# EAGLE board controller (EAGLE 6.6.0)
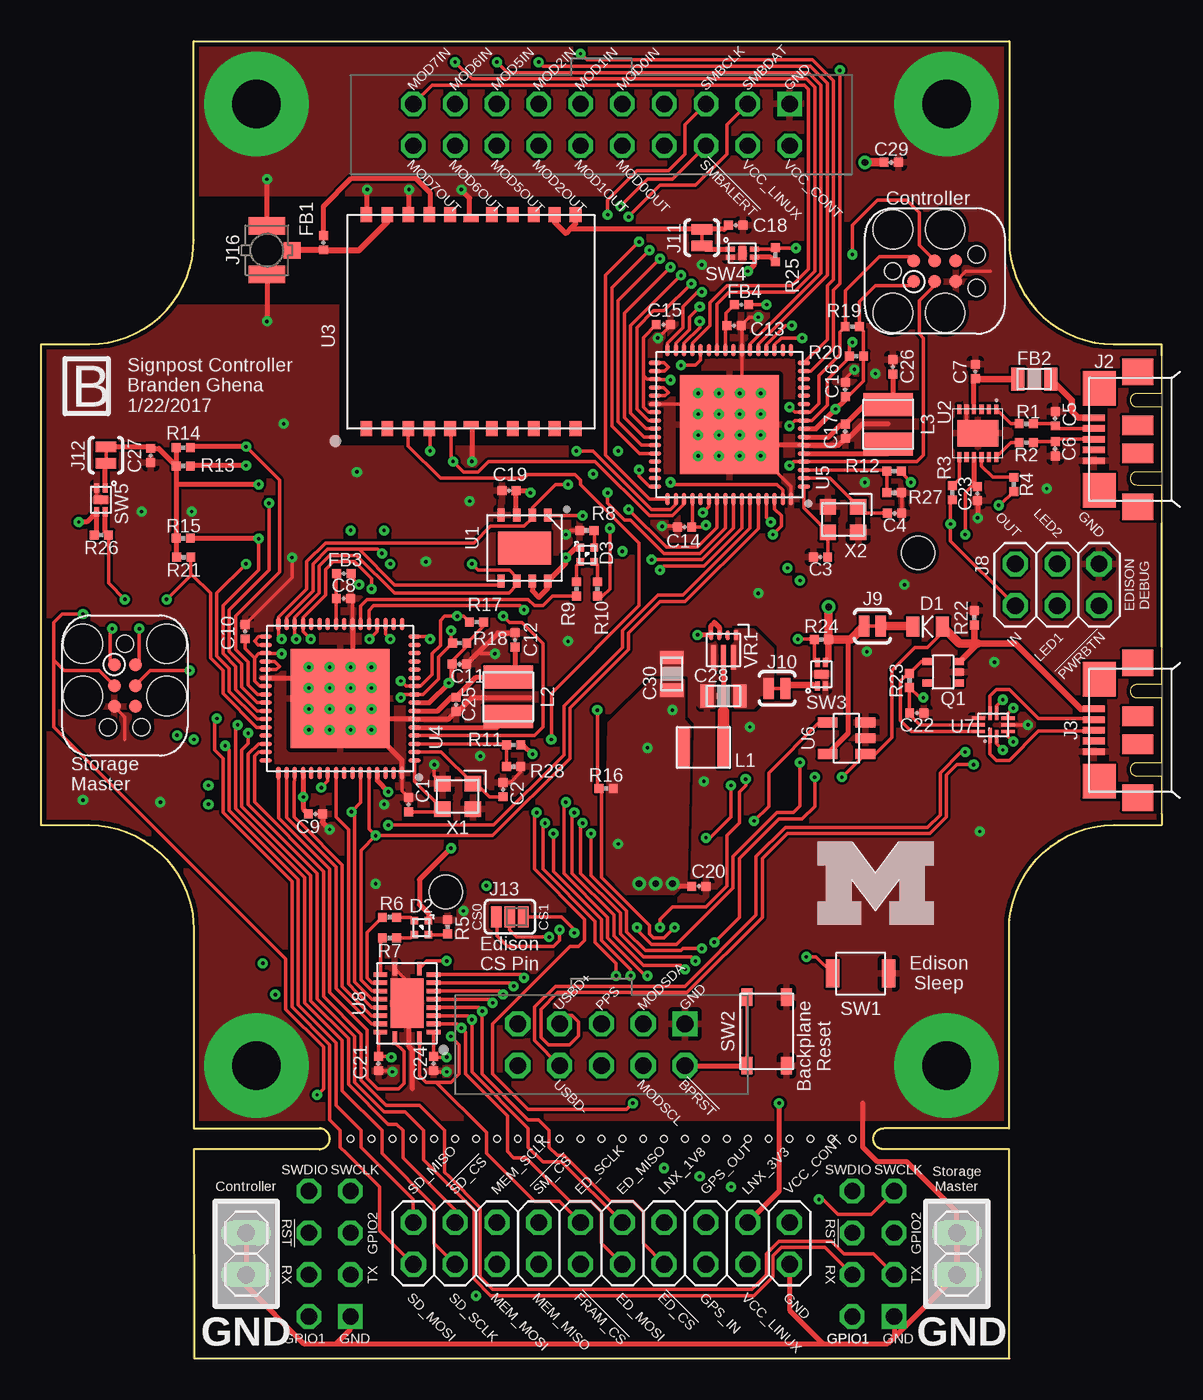
[diagram p5: board, top side]
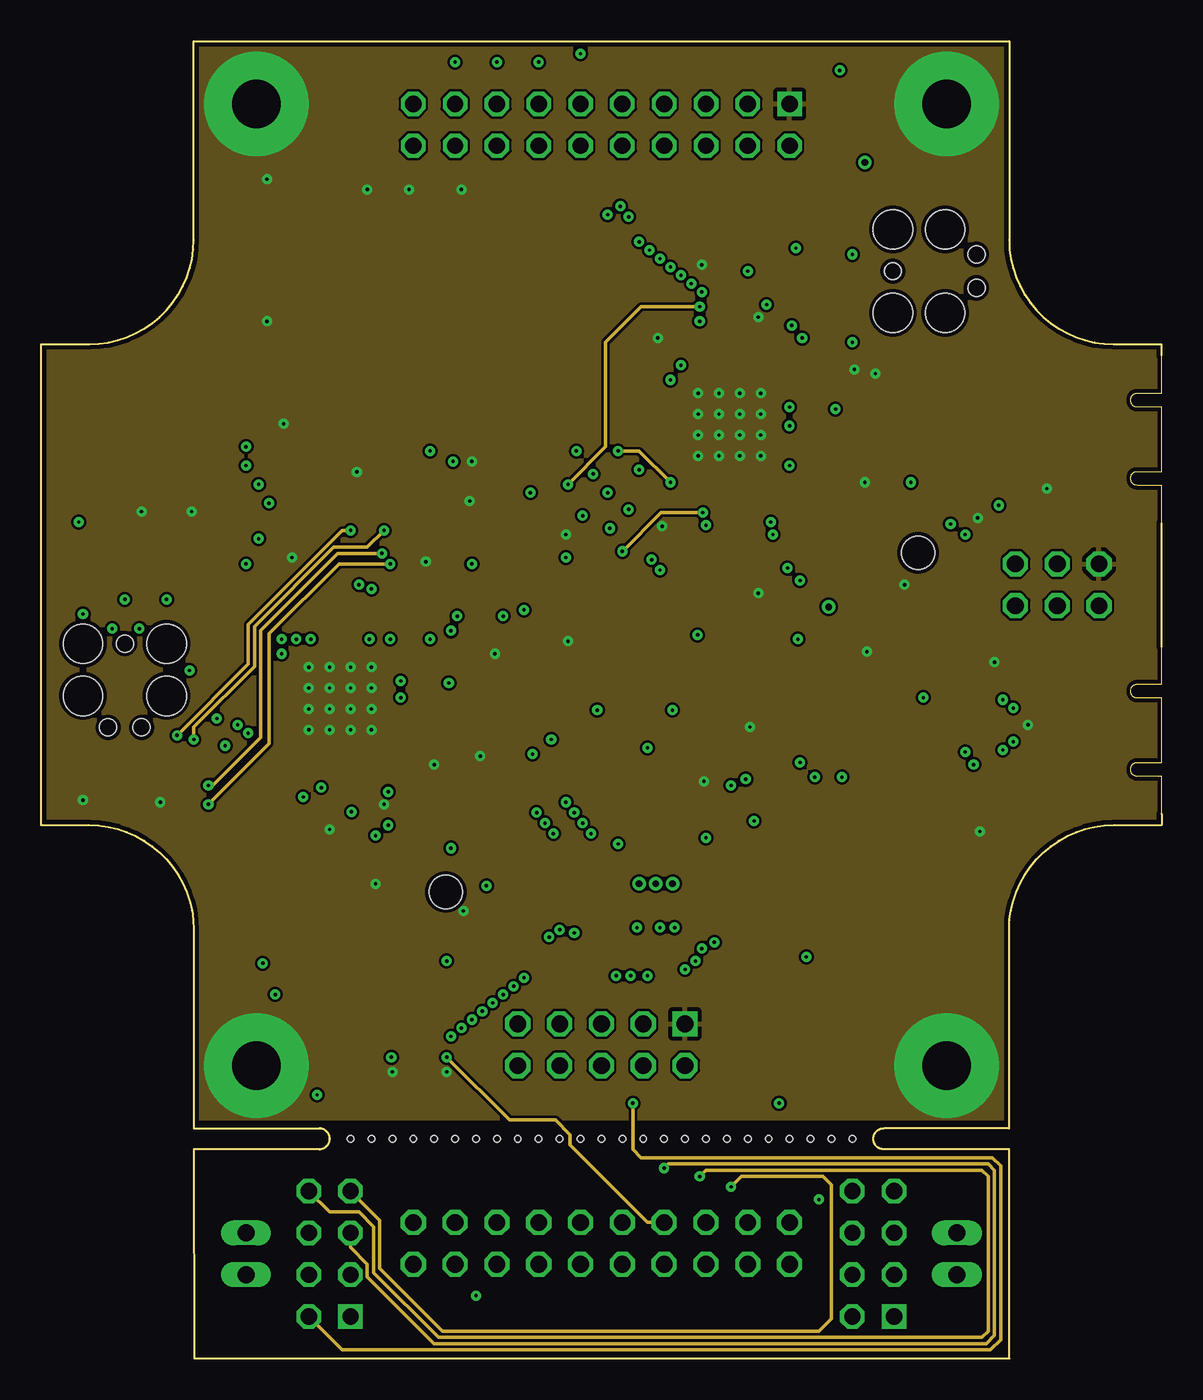
[diagram p6: board, inner layer Route2]
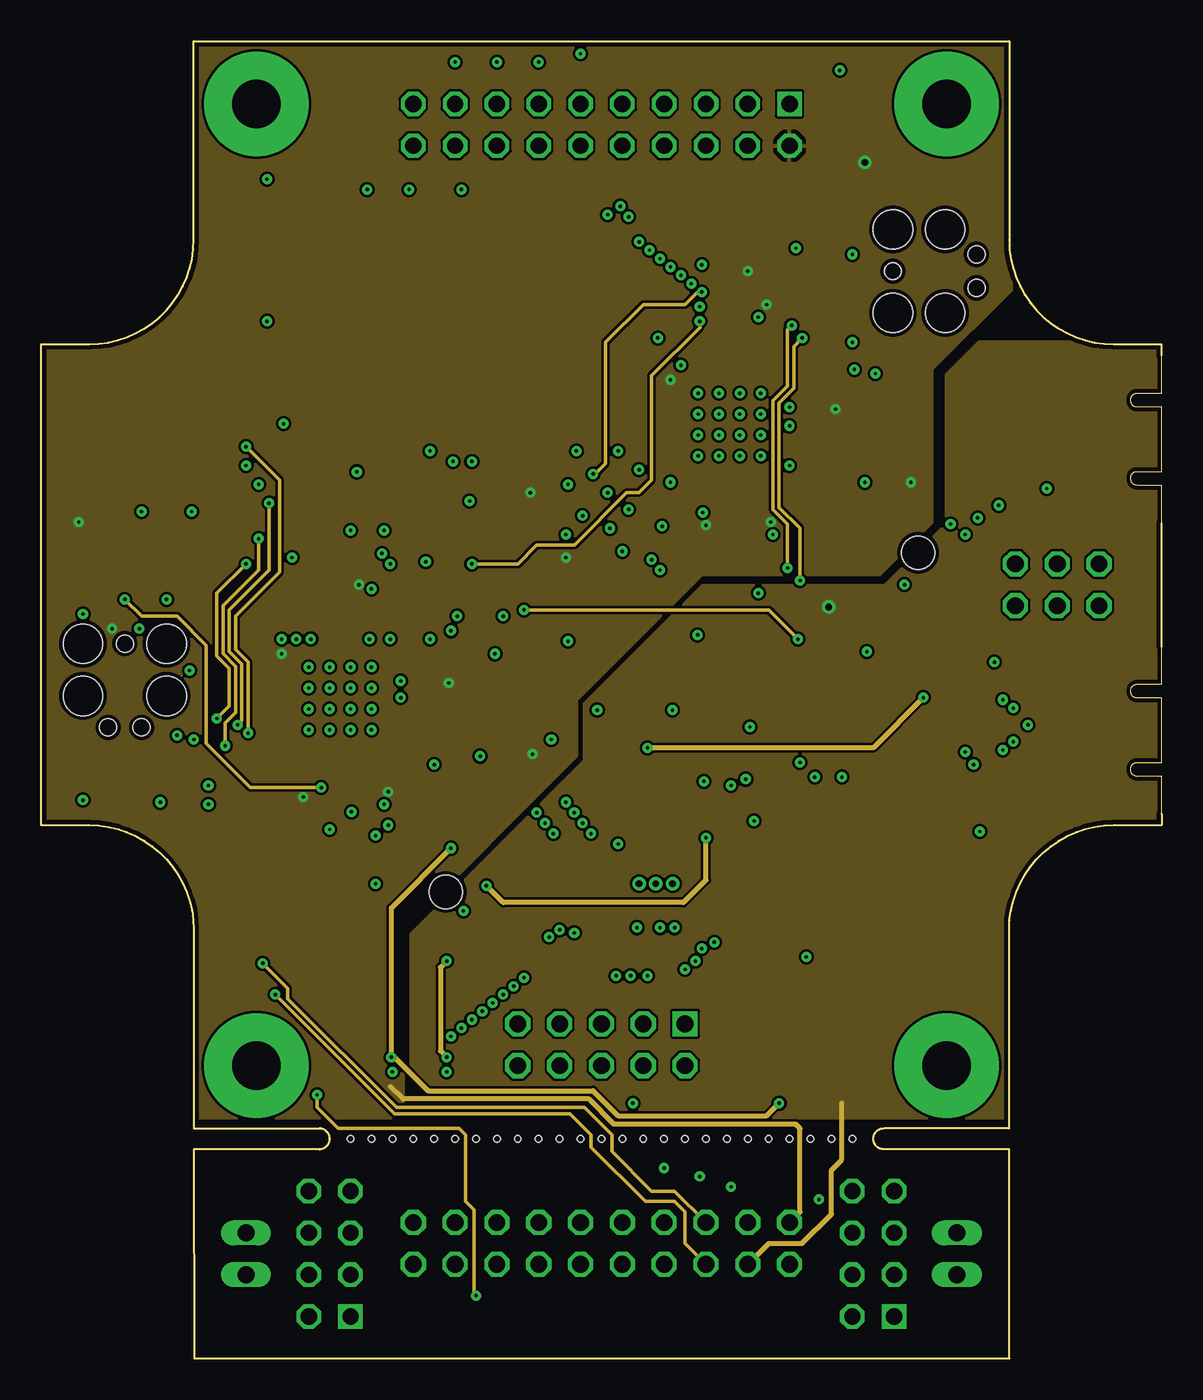
[diagram p7: board, inner layer Route15]
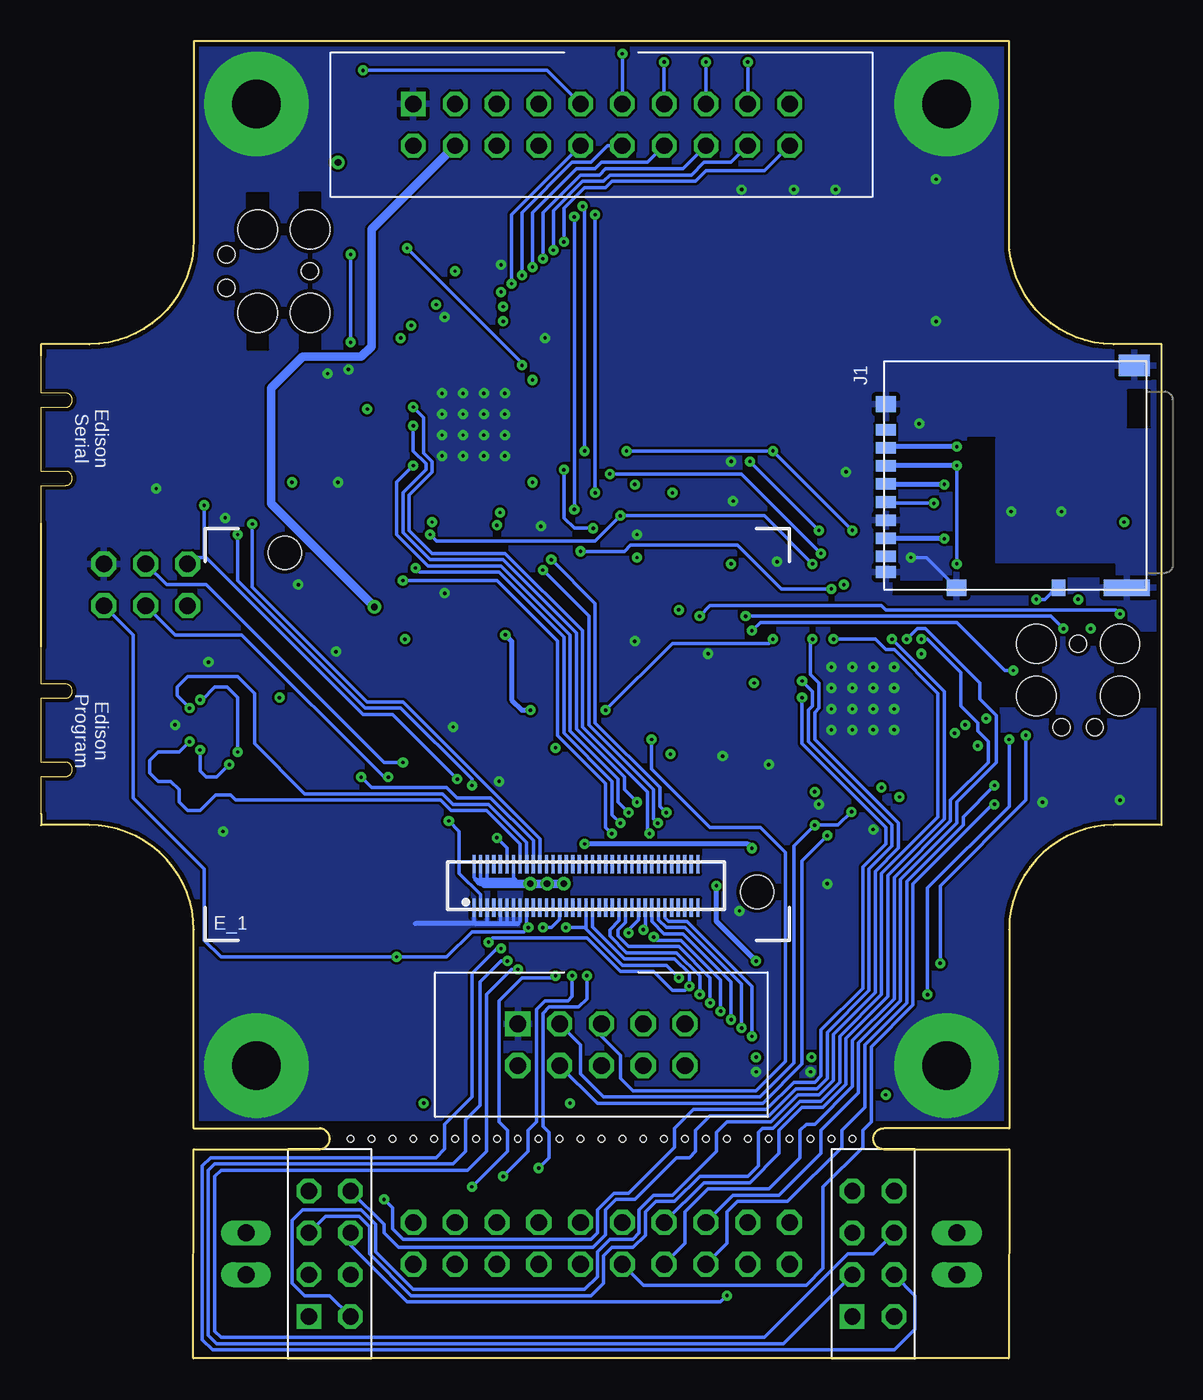
[diagram p8: board, bottom side, seen from below]

Size 68.07 x 80.01 mm. Coordinates in mm from the lower left corner, seen from the top.
Outline: 68.07,33.07 68.07,32.39 65.15,32.39 arc90 58.8,26.04 58.8,13.97 51.18,13.97 arc180 51.18,12.7 58.8,12.7 58.83,0 9.3,0 9.27,12.7 16.89,12.7 arc180 16.89,13.97 9.27,13.97 9.27,26.04 arc90 2.92,32.39 0,32.39 0,61.59 2.92,61.59 arc90 9.27,67.94 9.27,80.01 58.8,80.01 58.8,67.94 arc90 65.15,61.59 68.07,61.59 68.07,60.91
Outline: 68.07,43.23 68.07,50.72
Copper layers (1+2*15+16): Top 0.0178mm / dielectric 12mil / Route2 0.0356mm / dielectric 28mil / Route15 0.0356mm / dielectric 12mil / Bottom 0.0178mm
Design rules "sunstone-4lyr_v1.0.0.3 *": minimum track width 6mil, minimum drill 8mil, track to track 6mil, track to pad 6mil, pad to pad 6mil, via to via 6mil, smd to smd 6mil, copper to edge 10mil, drill to drill 16mil, minimum pad ring 8mil, minimum via ring 8mil, stop-mask expansion 3mil, vias tented up to drill 50mil, thermal gap 10mil

## Footprints (pad centres in the part's own frame; a part is rotated, then mirrored left to right if it is on the bottom)
0402_CAP = smd 0.536 x 0.546: 1 -0.433,0; 2 0.433,0
0805_CAP = smd 0.8 x 1.4: P$1 1,0; P$2 -1,0
0805_DIODE = smd 0.8 x 1.2: ANODE -0.9,0; CATHODE 0.9,0
1MM_SQ_4PAD = smd 0.457 x 0.457: 1 0.432,0.432; 2 0.432,-0.432; 3 -0.432,-0.432; 4 -0.432,0.432
EDISON_DAUGHTER = smd 1.14 x 0.2: 1 1.98,19.17; 2 4.62,19.17; 3 1.98,18.77; 4 4.62,18.77; 5 1.98,18.37; 6 4.62,18.37; 7 1.98,17.97; 8 4.62,17.97; 9 1.98,17.57; 10 4.62,17.57; 11 1.98,17.17; 12 4.62,17.17; 13 1.98,16.77; 14 4.62,16.77; 15 1.98,16.37; 16 4.62,16.37; 17 1.98,15.97; 18 4.62,15.97; 19 1.98,15.57; 20 4.62,15.57; 21 1.98,15.17; 22 4.62,15.17; 23 1.98,14.77; 24 4.62,14.77; 25 1.98,14.37; 26 4.62,14.37; 27 1.98,13.97; 28 4.62,13.97; 29 1.98,13.57; 30 4.62,13.57; 31 1.98,13.17; 32 4.62,13.17; 33 1.98,12.77; 34 4.62,12.77; 35 1.98,12.37; 36 4.62,12.37; 37 1.98,11.97; 38 4.62,11.97; 39 1.98,11.57; 40 4.62,11.57; 41 1.98,11.17; 42 4.62,11.17; 43 1.98,10.77; 44 4.62,10.77; 45 1.98,10.37; 46 4.62,10.37; 47 1.98,9.97; 48 4.62,9.97; 49 1.98,9.57; 50 4.62,9.57; 51 1.98,9.17; 52 4.62,9.17; 53 1.98,8.77; 54 4.62,8.77; 55 1.98,8.37; 56 4.62,8.37; 57 1.98,7.97; 58 4.62,7.97; 59 1.98,7.57; 60 4.62,7.57; 61 1.98,7.17; 62 4.62,7.17; 63 1.98,6.77; 64 4.62,6.77; 65 1.98,6.37; 66 4.62,6.37; 67 1.98,5.97; 68 4.62,5.97; 69 1.98,5.57; 70 4.62,5.57 | hole 2: 23.53,30.67; 2.93,1.98
DM3AT-SF-PEJM5 = smd 0.7 x 1.2: 1 3.2,-0.1; 2 2.1,-0.1; 3 1,-0.1; 4 -0.1,-0.1; 5 -1.2,-0.1; 6 -2.3,-0.1; 7 -3.4,-0.1; 8 -4.5,-0.1; B -5.45,-0.1 | smd 1 x 0.8: A -6.4,-10.6 | smd 1 x 1.2: MOUNT0 4.75,-0.1; MOUNT1 -6.4,-4.4 | smd 1 x 2.8: MOUNT2 -6.4,-14.75 | smd 1.3 x 1.9: MOUNT3 7.1,-15.2
USB_MICRO_B-HIROSE-ZX62R-B-5P = smd 0.4 x 1.35: 1 1.3,4.125; 2 0.65,4.125; 3 0,4.125; 4 -0.65,4.125; 5 -1.3,4.125 | smd 2.1 x 2: P$1 3.1,3.8; P$2 -3.1,3.8 | smd 1.6 x 1.9: P$3 -4.1,1.45; P$6 4.1,1.45 | smd 1.2 x 1.9: P$4 -0.85,1.45; P$5 0.85,1.45
MODULE_CONTROLLER = drill 0.991 square: 1 11.43,29.21; 100 -15.24,-44.45; 200 17.78,-44.45 | drill 0.991 octagon: 2 11.43,26.67; 3 8.89,29.21; 4 8.89,26.67; 5 6.35,29.21; 6 6.35,26.67; 7 3.81,29.21; 8 3.81,26.67; 9 1.27,29.21; 10 1.27,26.67; 11 -1.27,29.21; 12 -1.27,26.67; 13 -3.81,29.21; 14 -3.81,26.67; 15 -6.35,29.21; 16 -6.35,26.67; 17 -8.89,29.21; 18 -8.89,26.67; 19 -11.43,29.21; 20 -11.43,26.67; 101 -17.78,-44.45; 102 -15.24,-41.91; 103 -17.78,-41.91; 104 -15.24,-39.37; 105 -17.78,-39.37; 106 -15.24,-36.83; 107 -17.78,-36.83; 201 15.24,-44.45; 202 17.78,-41.91; 203 15.24,-41.91; 204 17.78,-39.37; 205 15.24,-39.37; 206 17.78,-36.83; 207 15.24,-36.83 | drill 1.016 square: 21 5.08,-26.67 | drill 1.016 octagon: 22 5.08,-29.21; 23 2.54,-26.67; 24 2.54,-29.21; 25 0,-26.67; 26 0,-29.21; 27 -2.54,-26.67; 28 -2.54,-29.21; 29 -5.08,-26.67; 30 -5.08,-29.21 | hole 0.381: 0,-33.655; 1.27,-33.655; -1.27,-33.655; 3.81,-33.655; 5.08,-33.655; 2.54,-33.655; -3.81,-33.655; -2.54,-33.655; -5.08,-33.655; 11.43,-33.655; 12.7,-33.655; 10.16,-33.655; 15.24,-33.655; 13.97,-33.655; 7.62,-33.655; 8.89,-33.655; 6.35,-33.655; -11.43,-33.655; -10.16,-33.655; -12.7,-33.655; -7.62,-33.655; -6.35,-33.655; -8.89,-33.655; -15.24,-33.655; -13.97,-33.655
1X02 = drill 1.016 long: 1 -1.27,0; 2 1.27,0
2X10 = drill 1.016 octagon: 1 -11.43,-1.27; 2 -11.43,1.27; 3 -8.89,-1.27; 4 -8.89,1.27; 5 -6.35,-1.27; 6 -6.35,1.27; 7 -3.81,-1.27; 8 -3.81,1.27; 9 -1.27,-1.27; 10 -1.27,1.27; 11 1.27,-1.27; 12 1.27,1.27; 13 3.81,-1.27; 14 3.81,1.27; 15 6.35,-1.27; 16 6.35,1.27; 17 8.89,-1.27; 18 8.89,1.27; 19 11.43,-1.27; 20 11.43,1.27
2X03 = drill 1.016 octagon: 1 -2.54,-1.27; 2 -2.54,1.27; 3 0,-1.27; 4 0,1.27; 5 2.54,-1.27; 6 2.54,1.27
SJ_2S-TRACE = smd 0.635 x 1.27: 1 -0.508,0; 2 0.508,0
SJ_3_PASTE2&3 = smd 0.635 x 1.27: 1 -0.813,0; 2 0,0; 3 0.813,0
TC2030-IDC = smd 0.787 x 0.787: 1 -1.27,-0.635; 2 -1.27,0.635; 3 0,-0.635; 4 0,0.635; 5 1.27,-0.635; 6 1.27,0.635 | hole 2.375: -2.54,2.54; 0.635,2.54; 0.635,-2.54; -2.54,-2.54 | hole 1.016: -2.54,0; 2.54,1.016; 2.54,-1.016
U.FL_SMT = smd 1.05 x 2.2: GND1 -1.475,0; GND2 1.475,0 | smd 1 x 1.05: SIG 0,-1.525
DFE322512C = smd 0.75 x 2.5: P$1 1.225,0; P$2 -1.225,0
1212 = smd 1.4 x 3: P$1 -1.2,0; P$2 1.2,0
SOT353 = smd 0.42 x 0.6: D1 0.65,-0.95; D2 -0.65,-0.95; G1 0.65,0.95; G2 -0.65,0.95; S 0,0.95
0402_RES = smd 0.536 x 0.546: 1 -0.433,0; 2 0.433,0
B3U-1000P = smd 0.8 x 1.7: 1 -1.7,0; 2 1.7,0
PTS810SJ = smd 1.05 x 0.65: 1 -2.075,1.2; 2 2.075,1.2; 3 2.075,-1.2; 4 -2.075,-1.2
TDFN4 = smd 0.3 x 0.55: 1 -0.25,-0.725; 2 0.25,-0.725; 3 0.25,0.725; 4 -0.25,0.725 | smd 0.86 x 0.5: PAD 0,0
TDFN-8 = smd 0.45 x 0.8: 1 -1.425,-2.007; 2 -0.475,-2.007; 3 0.475,-2.007; 4 1.425,-2.007; 5 1.425,2.007; 6 0.475,2.007; 7 -0.475,2.007; 8 -1.425,2.007 | smd 3.2 x 2: NC 0,0
DFN-12/3MM = smd 0.6 x 0.25: 1 -1.45,1.13; 2 -1.45,0.68; 3 -1.45,0.23; 4 -1.45,-0.23; 5 -1.45,-0.68; 6 -1.45,-1.13; 7 1.45,-1.13; 8 1.45,-0.68; 9 1.45,-0.23; 10 1.45,0.23; 11 1.45,0.68; 12 1.45,1.13 | smd 1.6 x 2.5: 13 0,0
RXM-GPS-RM-T = smd 0.711 x 0.914: 1 -6.35,-6.502; 2 -5.08,-6.502; 3 -3.81,-6.502; 4 -2.54,-6.502; 5 -1.27,-6.502; 6 1.27,-6.502; 7 2.54,-6.502; 8 3.81,-6.502; 9 5.08,-6.502; 10 6.35,-6.502; 11 6.35,6.502; 12 5.08,6.502; 13 3.81,6.502; 14 2.54,6.502; 15 1.27,6.502; 16 -1.27,6.502; 17 -2.54,6.502; 18 -3.81,6.502; 19 -5.08,6.502; 20 -6.35,6.502 | smd 0.914 x 0.457: 21 0,-6.274; 22 0,6.274
QFN-64-9MM = smd 0.75 x 0.28: 1 -4.525,3.75; 2 -4.525,3.25; 3 -4.525,2.75; 4 -4.525,2.25; 5 -4.525,1.75; 6 -4.525,1.25; 7 -4.525,0.75; 8 -4.525,0.25; 9 -4.525,-0.25; 10 -4.525,-0.75; 11 -4.525,-1.25; 12 -4.525,-1.75; 13 -4.525,-2.25; 14 -4.525,-2.75; 15 -4.525,-3.25; 16 -4.525,-3.75; 33 4.525,-3.75; 34 4.525,-3.25; 35 4.525,-2.75; 36 4.525,-2.25; 37 4.525,-1.75; 38 4.525,-1.25; 39 4.525,-0.75; 40 4.525,-0.25; 41 4.525,0.25; 42 4.525,0.75; 43 4.525,1.25; 44 4.525,1.75; 45 4.525,2.25; 46 4.525,2.75; 47 4.525,3.25; 48 4.525,3.75 | smd 0.28 x 0.75: 17 -3.75,-4.525; 18 -3.25,-4.525; 19 -2.75,-4.525; 20 -2.25,-4.525; 21 -1.75,-4.525; 22 -1.25,-4.525; 23 -0.75,-4.525; 24 -0.25,-4.525; 25 0.25,-4.525; 26 0.75,-4.525; 27 1.25,-4.525; 28 1.75,-4.525; 29 2.25,-4.525; 30 2.75,-4.525; 31 3.25,-4.525; 32 3.75,-4.525; 49 3.75,4.525; 50 3.25,4.525; 51 2.75,4.525; 52 2.25,4.525; 53 1.75,4.525; 54 1.25,4.525; 55 0.75,4.525; 56 0.25,4.525; 57 -0.25,4.525; 58 -0.75,4.525; 59 -1.25,4.525; 60 -1.75,4.525; 61 -2.25,4.525; 62 -2.75,4.525; 63 -3.25,4.525; 64 -3.75,4.525 | smd 6 x 6: GND 0,0
SOT-23-5 = smd 0.6 x 1.2: 1 -0.95,-1.15; 2 0,-1.15; 3 0.95,-1.15; 4 0.95,1.15; 5 -0.95,1.15
UQFN-10 = smd 0.2 x 0.9: 1 -0.2,-0.65 | smd 0.2 x 0.8: 2 0.2,-0.7; 6 0.2,0.7; 7 -0.2,0.7 | smd 0.8 x 0.2: 3 0.9,-0.4; 4 0.9,0; 5 0.9,0.4; 8 -0.9,0.4; 9 -0.9,0; 10 -0.9,-0.4
R-PVQFN-N20 = smd 0.825 x 0.28: 1 -2.112,-0.75; 10 2.112,-0.75; 11 2.112,0.75; 20 -2.112,0.75 | smd 0.28 x 0.825: 2 -1.75,-1.613; 3 -1.25,-1.613; 4 -0.75,-1.613; 5 -0.25,-1.613; 6 0.25,-1.613; 7 0.75,-1.613; 8 1.25,-1.613; 9 1.75,-1.613; 12 1.75,1.613; 13 1.25,1.613; 14 0.75,1.613; 15 0.25,1.613; 16 -0.25,1.613; 17 -0.75,1.613; 18 -1.25,1.613; 19 -1.75,1.613 | smd 3 x 2: THERMAL 0,0
RLT0007A = smd 0.6 x 0.25: 1 -0.9,0.75; 2 -0.9,0.25; 3 -0.9,-0.25; 4 -0.9,-0.75 | smd 1.5 x 0.3: 5 0.45,-0.6; 6 0.45,0; 7 0.45,0.6
FHXXX = smd 1 x 0.95: 1 -0.925,-0.775; 2 0.925,-0.775; 3 0.925,0.775; 4 -0.925,0.775

## Placement (x,y rotation side)
C1  8pF  [0402_CAP]  22.33,33.63 90 top
C2  8pF  [0402_CAP]  28.07,34.54 90 top
C3  8pF  [0402_CAP]  47.35,48.67 180 top
C4  8pF  [0402_CAP]  51.84,51.33 0 top
C5  47pF  [0402_CAP]  61.59,57.07 90 top
C6  47pF  [0402_CAP]  61.59,55.25 270 top
C7  10nF  [0402_CAP]  56.75,59.94 90 top
C8  100nF  [0402_CAP]  18.36,46.15 0 top
C9  100nF  [0402_CAP]  16.66,33.07 0 top
C10  100nF  [0402_CAP]  12.4,44.15 90 top
C11  100nF  [0402_CAP]  25.4,42.16 0 top
C12  100nF  [0402_CAP]  28.78,43.64 90 top
C13  100nF  [0402_CAP]  42.09,62.74 0 top
C14  100nF  [0402_CAP]  39.09,50.5 180 top
C15  100nF  [0402_CAP]  37.8,62.79 0 top
C16  100nF  [0402_CAP]  48.84,58.85 90 top
C17  100nF  [0402_CAP]  48.84,56.31 270 top
C18  100nF  [0402_CAP]  42.19,68.83 0 top
C19  100nF  [0402_CAP]  28.42,52.7 180 top
C20  100nF  [0402_CAP]  39.95,28.68 0 top
C21  100nF  [0402_CAP]  20.49,17.91 90 top
C22  100nF  [0402_CAP]  53.19,39.19 0 top
C23  100nF  [0402_CAP]  56.87,52.53 270 top
C24  100nF  [0402_CAP]  23.84,17.91 90 top
C25  4.7uF  [0402_CAP]  25.2,39.73 270 top
C26  4.7uF  [0402_CAP]  51.74,60.22 90 top
C27  4.7uF  [0402_CAP]  6.65,54.84 270 top
C28  10uF  [0805_CAP]  41.45,40.23 0 top
C29  10uF  [0402_CAP]  51.64,72.64 0 top
C30  22uF  [0805_CAP]  38.3,41.58 270 top
D1  DIODE  [0805_DIODE]  53.85,44.45 180 top
D2  SML-LX0404SIUPGUSB  [1MM_SQ_4PAD]  23.09,26.16 0 top
D3  SML-LX0404SIUPGUSB  [1MM_SQ_4PAD]  33.17,48.82 90 top
E_1  EDISON_CONNECTOR_SEGMENTED  [EDISON_DAUGHTER]  22.61,25.4 90 bottom
FB1  300Ω  [0402_CAP]  17.15,67.77 270 top
FB2  600Ω  [0805_CAP]  60.33,59.49 180 top
FB3  1.5kΩ  [0402_CAP]  18.39,47.68 0 top
FB4  1.5kΩ  [0402_CAP]  42.55,64.01 0 top
J1  DM3AT-SF-PEJM5  [DM3AT-SF-PEJM5]  16.87,53.21 90 bottom
J2  MICRO_USB_B_HIROSE_ZX62R-B-5P  [USB_MICRO_B-HIROSE-ZX62R-B-5P]  68.07,55.83 90 top
J3  MICRO_USB_B_HIROSE_ZX62R-B-5P  [USB_MICRO_B-HIROSE-ZX62R-B-5P]  68.07,38.15 90 top
J4  MODULE_CONTROLLER  [MODULE_CONTROLLER]  34.04,46.99 0 top
J5  [1X02]  12.45,6.35 90 top
J6  [1X02]  55.63,6.35 90 top
J7  [2X10]  34.04,6.98 0 top
J8  [2X03]  61.72,46.99 180 top
J9  SOLDERJUMPERTRACE  [SJ_2S-TRACE]  50.5,44.48 0 top
J10  SOLDERJUMPERTRACE  [SJ_2S-TRACE]  44.7,40.69 180 top
J11  SOLDERJUMPERTRACE  [SJ_2S-TRACE]  40.13,68.07 90 top
J12  SOLDERJUMPERTRACE  [SJ_2S-TRACE]  3.94,54.86 90 top
J13  [SJ_3_PASTE2&3]  28.47,26.82 0 top
J14  TC2030-JLINK-L  [TC2030-IDC]  5.08,40.87 270 top
J15  TC2030-JLINK-L  [TC2030-IDC]  54.28,66.04 0 top
J16  U.FL-R-SMT  [U.FL_SMT]  13.72,67.31 90 top
L1  0.47uH  [DFE322512C]  40.23,37.11 0 top
L2  22uH  [1212]  28.37,40.18 270 top
L3  22uH  [1212]  51.46,56.74 270 top
LOGO1  UMICH_SOLID_MEDIUM  [UMICH_SOLID_200MIL]  47.14,26.31 0 top
Q1  DMN32D2LDF  [SOT353]  54.79,41.68 270 top
R1  27Ω  [0402_RES]  59.84,56.77 180 top
R2  27Ω  [0402_RES]  59.84,55.63 180 top
R3  100Ω  [0402_RES]  55.36,52.58 270 top
R4  100Ω  [0402_RES]  59.08,53.09 270 top
R5  1kΩ  [0402_RES]  24.69,26.21 90 top
R6  1kΩ  [0402_RES]  21.16,26.8 180 top
R7  1kΩ  [0402_RES]  21.16,25.53 180 top
R8  1kΩ  [0402_RES]  33.15,50.29 180 top
R9  1kΩ  [0402_RES]  32.51,46.74 270 top
R10  1kΩ  [0402_RES]  33.78,46.74 270 top
R11  10kΩ  [0402_RES]  28.7,37.26 0 top
R12  10kΩ  [0402_RES]  51.82,53.9 0 top
R13  10kΩ  [0402_RES]  8.64,54.21 180 top
R14  10kΩ  [0402_RES]  8.64,55.31 180 top
R15  10kΩ  [0402_RES]  8.64,49.81 180 top
R16  10kΩ  [0402_RES]  34.32,34.62 0 top
R17  100kΩ  [0402_RES]  26.44,44.73 0 top
R18  100kΩ  [0402_RES]  25.43,43.46 0 top
R19  100kΩ  [0402_RES]  49.28,62.66 0 top
R20  100kΩ  [0402_RES]  49.53,60.88 0 top
R21  100kΩ  [0402_RES]  8.66,48.66 180 top
R22  100kΩ  [0402_RES]  56.69,44.98 90 top
R23  100kΩ  [0402_RES]  52.76,41.17 90 top
R24  1MΩ  [0402_RES]  47.4,43.66 0 top
R25  1MΩ  [0402_RES]  44.6,67.03 270 top
R26  1MΩ  [0402_RES]  3.66,50.01 180 top
R27  DNP  [0402_RES]  51.82,52.58 180 top
R28  DNP  [0402_RES]  28.7,35.94 180 top
SW1  B3U-1000P  [B3U-1000P]  49.78,23.37 0 top
SW2  PTS810SJ  [PTS810SJ]  44.07,19.86 90 top
SW3  SIP3240X  [TDFN4]  47.4,41.55 0 top
SW4  SIP3240X  [TDFN4]  42.6,67.13 270 top
SW5  SIP3240X  [TDFN4]  3.63,52.15 180 top
U1  FM25CLXXB-DG  [TDFN-8]  29.36,49.23 180 top
U2  FTDI234XD  [DFN-12/3MM]  56.9,56.2 270 top
U3  RXM-GPS-RM-T  [RXM-GPS-RM-T]  26.11,62.97 0 top
U4  SAM4LC8BA  [QFN-64-9MM]  18.16,40.08 180 top
U5  SAM4LC8BA  [QFN-64-9MM]  41.81,56.72 180 top
U6  SN74LVC1G125DBVR  [SOT-23-5]  48.92,37.67 90 top
U7  TS3USB30E  [UQFN-10]  57.84,38.48 0 top
U8  TXS0108EVQFN20  [R-PVQFN-N20]  22.23,21.56 90 top
VR1  TPS62086  [RLT0007A]  41.45,43.03 270 top
X1  16MHz  [FHXXX]  25.3,34.14 180 top
X2  16MHz  [FHXXX]  48.72,50.95 180 top

## Tracks (layer width: path | path; a pad name or v marks a point on that pad's centre or on a via)
!BACKPLANE_RESET
  Top 0.203: SW2.2 SW2.1
  Top 0.305: J4.22 SW2.1
!CONTROLLER_LED  (via drill 0.2)
  Top 0.203: U5.48 36.95,52.97 36.32,53.59 v36.32,53.98 | v34.54,50.42 34.54,46.74 34.11,46.3 R10.2
  Bottom 0.203: v34.54,50.42 35.69,50.42 36.32,51.05 v36.32,53.98
!CONTROLLER_RESET  (via drill 0.2)
  Top 0.203: J15.3 54.28,65.2 53.34,64.26 53.34,62.23 53.59,61.98 53.59,54.86 53.2,54.47 U5.4 45.7,54.47 v45.47,54.23 | v32.38,33.15 32.26,33.02 32.26,29.46 34.8,26.92 34.8,25.65 36.58,23.88 38.86,23.88 v39.12,23.62
  Bottom 0.203: v45.47,54.23 46.48,53.21 46.48,50.04 44.58,48.13 40.13,48.13 35.94,43.94 35.94,38.1 33.02,35.18 33.02,33.78 v32.38,33.15 | v39.12,23.62 39.5,23.62 41.02,22.1 41.02,12.57 42.16,11.43 57.15,11.43 57.53,11.05 57.53,1.65 57.15,1.27 24.13,1.27 19.05,6.35 17.53,6.35 J4.105
!EDISON_PWRBTN  (via drill 0.2)
  Top 0.203: U4.16 23.48,43.83 v23.62,43.69 | v33.78,39.37 33.78,34.72 R16.1 34.04,34.47 34.04,29.21 36.96,26.29 36.96,25.78 37.21,25.53 37.85,25.53 v38.48,26.16 | v46.48,24.38 47.07,24.38 SW1.1
  Bottom 0.203: v23.62,43.69 23.88,43.43 29.72,43.43 v33.78,39.37 | J8.2 62.48,43.94 62.48,34.04 58.17,29.72 58.17,25.4 57.15,24.38 v46.48,24.38 43.43,24.38 41.91,25.91 38.73,25.91 v38.48,26.16 38.58,26.26 E_1.17
!EDISON_SPI_CS
  Top 0.203: U4.56 17.91,32.9 18.67,32.14 18.67,22.73 19.18,22.23 19.3,22.1 20.09,21.32 U8.16
!EDISON_SPI_CS_1V8  (via drill 0.2)
  Top 0.203: U8.5 26.56,21.32 v26.8,21.08 26.8,17.27 29.59,14.48 30.23,14.48 30.86,13.84 30.86,12.83 31.37,12.32 31.75,12.32 34.54,9.52 35.94,9.52 36.58,8.89 36.58,6.98 J7.13 | J13.2 28.45,26.8 28.45,26.04 28.89,25.59 v30.86,25.59
  Bottom 0.203: v30.86,25.59 30.67,25.4 29.21,25.4 26.8,22.99 v26.8,21.08
!FRAM_CS  (via drill 0.2)
  Top 0.203: U5.62 44.56,51.58 44.96,51.18 44.96,50.55 v44.45,50.04 | v32.89,51.18 30.84,51.18 U1.1
  Route2 0.203: v21.21,48.26 18.09,48.26 13.84,44.02 13.84,37.34 v10.16,33.66
  Bottom 0.203: v44.45,50.04 44.04,49.63 34.44,49.63 v32.89,51.18 24.13,51.18 v21.21,48.26 | J7.9 31.5,4.45 21.59,4.45 20.57,5.46 20.57,10.41 18.16,12.83 18.16,13.84 17.65,14.35 17.65,18.92 15.11,21.46 15.11,28.83 10.29,33.66 v10.16,33.66
!SD_CS  (via drill 0.2)
  Top 0.203: U4.40 13.14,40.33 12.57,40.89 12.57,42.29 11.81,43.05 11.81,45.09 14.48,47.75 14.48,53.34 v12.45,55.37 | J7.4 25.15,9.02 21.97,12.19 21.97,13.84 21.59,14.22 21.08,14.22 18.67,16.64 18.67,19.43 16.38,21.72 16.38,29.34 12.19,33.53 12.19,36.96 12.57,37.34 v12.57,37.97
  Top 0.305: v12.45,55.37 9.13,55.37 R14.1
  Route15 0.203: v12.45,55.37 14.48,53.34 14.48,47.75 11.81,45.09 11.81,43.05 12.57,42.29 v12.57,37.97
  Bottom 0.305: v12.45,55.37 16.71,55.37 J1.2
!SD_DETECT  (via drill 0.2)
  Top 0.203: U4.44 13.1,38.33 11.05,40.39 11.05,41.78 10.29,42.55 10.29,46.48 9.21,47.56 | R21.1 9.09,47.68 | 9.09,47.68 9.09,47.58 | 9.21,47.56 9.09,47.68 | v7.62,46.1 9.08,47.56 9.21,47.56
  Bottom 0.203: 6.4,46.81 7.11,46.1 v7.62,46.1
  Bottom 0.305: 6.35,46.9 J1.A 6.4,46.81
!SMBALERT  (via drill 0.2)
  Top 0.203: J4.6 38.35,71.63 36.83,71.63 v35.18,69.98 | U5.63 45.06,52.73 44.7,53.09 38.35,53.09 v38.23,53.21
  Route2 0.203: v38.23,53.21 36.32,55.12 v35.05,55.12
  Bottom 0.203: v35.18,69.98 35.05,69.85 v35.05,55.12
!STORAGE_CS  (via drill 0.2)
  Top 0.203: U4.29 15.91,44.87 | U4.29 15.91,44.99 17.27,46.36 17.27,47.93 17.73,48.39 19.05,48.39 20.07,47.37 v20.07,46.74 | U5.54 40.56,51.73 v40.2,51.37 | U4.29 15.91,44.16 v16.38,43.69
  Route2 0.203: v40.2,51.37 37.66,51.37 v35.31,49.02
  Bottom 0.203: v20.07,46.74 23.11,46.74 25.78,49.4 32.26,49.4 32.64,49.02 v35.31,49.02 | v16.38,43.69 13.21,40.51 13.21,32.77 16.64,29.34 16.64,21.97 19.18,19.43 19.18,16.64 20.57,15.24 21.84,15.24 23.24,13.84 23.24,12.45 25.02,10.67 27.81,10.67 J7.8
!STORAGE_LED
  Top 0.203: U4.22 19.41,45.7 19.81,46.1 29.59,46.1 29.97,45.72 30.48,45.72 31.06,46.3 R9.2
!STORAGE_RESET  (via drill 0.2)
  Top 0.203: 0.76,42.42 0.76,44.7 1.27,45.21 v2.54,45.21 | J14.3 3.53,41.78 1.4,41.78 0.76,42.42 | U4.4 29.96,37.83 30.48,38.35 30.48,43.43 29.21,44.7 28.45,44.7 v28.07,45.09 | 0.76,42.42 0.76,38.35 14.86,24.26 14.86,21.21 17.15,18.92 17.15,16.38 v16.76,16
  Route15 0.203: v16.76,16 16.76,15.24 18.03,13.97 25.4,13.97 25.78,13.59 25.78,9.52 26.29,9.02 26.29,3.94 v26.42,3.81
  Bottom 0.203: v28.07,45.09 27.43,45.72 17.02,45.72 16.76,45.47 2.79,45.47 v2.54,45.21 | v26.42,3.81 26.8,3.43 45.85,3.43 49.28,6.86 J4.205
CONTROLLER_BUCK/LDO_N
  Top 0.203: U5.3 51.31,53.97 R12.1 R27.2
CONTROLLER_DEBUG_GPIO1  (via drill 0.2)
  Top 0.203: U5.57 42.06,50.44 40.13,48.51 v37.08,48.51 | v30.1,33.15 29.97,33.02 29.97,29.72 33.02,26.67 33.02,25.4 32.64,25.02 32.13,25.02 27.43,20.32 27.43,17.27 29.59,15.11 35.56,15.11 v35.94,15.49
  Route2 0.203: v35.94,15.49 35.94,12.7 36.45,12.19 57.78,12.19 58.29,11.68 58.29,1.14 57.66,0.51 18.29,0.51 J4.101
  Bottom 0.203: v37.08,48.51 34.42,45.85 34.42,38.61 30.48,34.67 30.48,33.53 v30.1,33.15
CONTROLLER_DEBUG_GPIO2  (via drill 0.2)
  Top 0.203: U5.58 42.56,50.43 40.26,48.13 37.85,48.13 v37.59,47.88 | v30.61,32.51 30.48,32.39 30.48,29.72 33.66,26.54 33.66,25.27 34.93,24 v34.93,23.24
  Route2 0.203: v37.85,11.56 38.1,11.81 57.53,11.81 57.91,11.43 57.91,1.4 57.4,0.89 23.88,0.89 19.81,4.95 19.81,5.72 18.8,6.73 J4.104
  Bottom 0.203: v37.59,47.88 34.8,45.09 34.8,38.48 30.86,34.54 30.86,32.77 v30.61,32.51 | v34.93,23.24 34.93,21.84 35.43,21.34 37.21,21.34 37.59,20.96 37.59,14.1 37.21,13.72 37.21,12.19 v37.85,11.56
CONTROLLER_DEBUG_RX  (via drill 0.2)
  Top 0.203: U5.19 44.56,61.58 44.96,61.98 v46.23,61.98 | v33.4,31.88 33.4,29.34 35.56,27.18 35.56,25.91 36.7,24.77 38.86,24.77 38.99,24.89 v40.13,24.89
  Route15 0.203: v46.23,61.98 45.72,61.47 45.72,58.93 44.83,58.04 44.83,51.69 46.1,50.42 v46.1,47.24
  Bottom 0.203: v46.1,47.24 40.39,47.24 36.7,43.56 36.7,37.85 33.78,34.93 33.78,32.26 v33.4,31.88 | v40.13,24.89 40.39,24.89 41.91,23.37 41.91,15.88 43.56,14.22 43.56,12.72 44.09,12.19 57.78,12.19 58.29,11.68 58.29,1.14 57.66,0.51 16.26,0.51 14.99,1.78 14.99,3.81 J4.103
CONTROLLER_DEBUG_TX  (via drill 0.2)
  Top 0.203: U5.20 44.06,61.58 45.21,62.74 v45.59,62.74 | v32.89,32.51 32.77,32.39 32.77,29.46 35.18,27.05 35.18,25.78 36.58,24.38 39.5,24.38 v39.75,24.13
  Route15 0.203: v45.59,62.74 45.34,62.48 45.34,59.05 44.45,58.17 44.45,51.56 45.34,50.67 v45.34,48.01
  Bottom 0.203: v45.34,48.01 45.09,47.75 40.26,47.75 36.32,43.82 36.32,37.97 33.4,35.05 33.4,33.02 v32.89,32.51 | v39.75,24.13 40.13,24.13 41.4,22.86 41.4,15.37 42.29,14.48 42.29,12.57 43.05,11.81 57.53,11.81 57.91,11.43 57.91,1.4 57.4,0.89 22.99,0.89 J4.102
CONTROLLER_SWDCLK  (via drill 0.2)
  Top 0.203: v49.28,61.72 49.1,61.54 R20.1 49.1,60.78 47.75,59.44 47.75,57.91 46.81,56.97 U5.9 45.79,56.97 v45.47,56.64 | J15.4 53.34,67.62 53.34,69.6 52.58,70.36 50.8,70.36 49.28,68.83 v49.28,67.06 | v31.88,33.78 31.75,33.66 31.75,29.46 34.42,26.8 34.42,25.53 36.7,23.24 v36.83,23.24
  Route2 0.203: v41.91,10.41 42.55,11.05 47.5,11.05 48.01,10.54 48.01,2.41 47.24,1.65 24.38,1.65 20.57,5.46 20.57,8.38 J4.106
  Bottom 0.203: v49.28,61.72 v49.28,67.06 | v45.47,56.64 45.47,55.12 44.7,54.36 44.7,53.98 46.1,52.58 46.1,50.16 44.45,48.51 40.01,48.51 35.56,44.07 35.56,38.23 32.64,35.31 32.64,34.54 v31.88,33.78 | v36.83,23.24 36.96,23.11 38.86,23.11 40.26,21.72 40.26,14.35 39.75,13.84 39.75,12.57 v41.91,10.41
CONTROLLER_SWDIO  (via drill 0.2)
  Top 0.203: J15.2 52.76,66.93 50.93,66.93 48.84,64.84 R19.1 48.51,62.33 48.51,60.96 47.24,59.69 47.24,57.99 46.72,57.47 U5.10 45.78,57.47 v45.47,57.79 | v31.12,31.88 31.12,29.59 34.04,26.67 34.04,25.4 35.81,23.62 v35.81,23.24
  Route2 0.203: v40.01,11.05 40.39,11.43 57.15,11.43 57.53,11.05 57.53,1.65 57.15,1.27 24.13,1.27 20.19,5.21 20.19,8 19.3,8.89 17.53,8.89 J4.107
  Bottom 0.203: v45.47,57.79 44.83,57.15 44.83,54.99 44.32,54.48 44.32,53.85 45.72,52.45 45.72,50.29 44.32,48.9 39.88,48.9 35.18,44.2 35.18,38.35 31.24,34.42 31.24,32 v31.12,31.88 | v35.81,23.24 35.81,21.97 36.07,21.72 37.47,21.72 37.97,21.21 37.97,14.35 38.48,13.84 38.48,12.57 v40.01,11.05
CONTROLLER_XIN
  Top 0.203: U5.1 46.33,51.64 X2.3 47.79,48.68 C3.1
CONTROLLER_XOUT
  Top 0.203: U5.2 47.9,53.47 X2.1 50.04,51.33 C4.1
D+
  Top 0.203: J2.3 61.75,55.83 C6.1 60.33,55.68 R2.1
D-
  Top 0.203: J2.2 61.76,56.48 C5.1 61.47,56.77 R1.1
EDISON_LED1  (via drill 0.2)
  Top 0.203: U8.8 28.49,22.82 v28.7,22.61 28.83,22.48 | v40.89,25.27 42.42,26.8 42.42,30.35 44.83,32.77 46.23,32.77 46.99,33.53 v46.99,35.31
  Bottom 0.203: E_1.37 34.58,26.19 32.64,24.26 29.59,24.26 28.7,23.37 v28.7,22.61 28.96,22.35 29.72,22.35 30.86,23.5 32.89,23.5 34.93,25.53 40.64,25.53 v40.89,25.27 | v46.99,35.31 47.24,35.31 55.88,43.94 59.94,43.94 J8.4
EDISON_LED2  (via drill 0.2)
  Top 0.203: U8.9 29.14,23.32 v29.34,23.11 | v36.2,26.16 36.2,26.04 37.08,25.15 38.61,25.15 42.04,28.58 42.04,30.48 44.7,33.15 45.7,33.15 46.1,33.55 v46.1,36.2
  Bottom 0.203: E_1.35 34.98,26.09 | 34.98,26.09 32.77,23.88 30.1,23.88 v29.34,23.11 | v46.1,36.2 47.24,36.2 58.04,46.99 60.45,46.99 J8.3 | v36.2,26.16 35.05,26.16 34.98,26.09
EDISON_SPI_MISO
  Top 0.203: U4.51 15.41,35.1 15.37,35.05 15.37,32.89 15.88,32.39 18.29,29.97 18.29,22.61 20.08,20.82 U8.17
EDISON_SPI_MISO_1V8  (via drill 0.2)
  Top 0.203: U8.4 25.92,20.82 v26.16,20.57 26.16,17.4 29.59,13.97 29.59,12.83 30.48,11.94 31.62,11.94 J7.12
  Bottom 0.203: E_1.55 30.98,26.53 30.23,25.78 29.08,25.78 26.16,22.86 v26.16,20.57
EDISON_SPI_MOSI
  Top 0.203: 14.91,35.23 U4.50 14.91,32.84 15.75,32 17.91,29.85 17.91,22.48 20.07,20.32 U8.18
EDISON_SPI_MOSI_1V8  (via drill 0.2)
  Top 0.203: U8.3 25.28,20.32 v25.53,20.07 25.78,19.81 25.78,17.27 28.32,14.73 28.32,12.57 28.7,12.19 29.46,12.19 32.13,9.52 33.4,9.52 34.04,8.89 34.04,6.98 J7.11
  Bottom 0.203: E_1.57 30.58,26.64 30.1,26.16 28.96,26.16 25.53,22.73 v25.53,20.07
EDISON_SPI_SCLK
  Top 0.203: U4.49 14.41,32.83 17.53,29.72 17.53,22.23 19.81,19.94 19.81,17.02 20.45,16.38 21.72,16.38 22.04,16.7 22.04,18.64 21.48,19.2 U8.20
EDISON_SPI_SCLK_1V8  (via drill 0.2)
  Top 0.203: U8.1 22.98,17.16 23.37,16.76 23.62,16.76 24,16.76 | 24,16.76 24.89,16.76 25.4,17.27 25.4,19.05 v24.89,19.56 | J7.10 31.5,9.52 29.97,9.52 27.05,12.45 27.05,13.72 24,16.76
  Bottom 0.203: E_1.59 30.18,26.75 29.97,26.54 28.83,26.54 24.89,22.61 v24.89,19.56
EDISON_UART_RX  (via drill 0.2)
  Top 0.203: R3.2 55.25,52.03 v55.25,50.67 55.25,49.66 J8.6
  Bottom 0.203: E_1.22 37.78,31.55 46.1,39.88 48.26,39.88 55.25,46.86 v55.25,50.67
EDISON_UART_TX  (via drill 0.2)
  Top 0.203: v37.59,26.16 37.59,26.67 38.35,27.43 40.39,27.43 41.66,28.7 41.66,31.75 42.42,32.51 42.42,34.42 42.8,34.8 v42.8,35.18 | R4.2 58.24,51.82 v58.17,51.82
  Bottom 0.203: v42.8,35.18 46.74,39.12 48.51,39.12 58.04,48.64 | 58.04,48.64 58.17,48.77 v58.17,51.82 | J8.5 58.8,48.64 58.04,48.64 | E_1.27 36.58,26.67 37.08,26.16 v37.59,26.16
GND  (via drill 0.2, 2.95 pad 6.35)
  Top 0.203: C16.2 48.84,59.51 v49.4,60.07 | R27.1 52.27,52.55 C4.2 | J15.5 56.19,66.04 57.66,66.04 | U5.38 40.56,57.97 U5.GND | U5.GND 42.56,57.47 U5.23 42.56,62.7 C13.2 43.03,63.25 v43.56,63.25 | U5.64 45.56,52.97 U5.GND | U2.13 56.22,56.88 U2.5 | U4.23 18.91,46.04 C8.2 | J14.5 5.08,38.96 5.08,37.59 | 21.84,35.56 U4.64 21.91,34.48 C1.2 | C24.1 23.91,17.4 v24.64,17.4 | C19.2 27.94,52.65 | U7.4 v59.94,38.48 | 38.23,62.61 C15.2 38.23,62.74 v37.47,61.98 | C14.2 38.61,50.55 v37.72,50.55 | C2.2 28.5,34.98 29.14,35.61 R28.1 | X1.2 23.88,35.41 v23.88,36.07 | R8.2 32.13,50.29 v31.88,50.04 | 20.32,37.85 20.32,37.92 U4.GND | SW5.2 3.38,52.4 SW5.PAD | 26.58,42.91 26.7,42.8 v27.56,42.8 | C10.2 15.24,47.42 15.24,48.77 | U8.11 22.23,22.93 U8.THERMAL | C21.1 21.26,17.47 v21.34,17.4
  Top 0.305: 51.45,56.77 49.91,56.77 49.02,55.88 C17.2 48.43,55.47 U5.6 43.06,55.47 U5.GND | C23.2 56.9,52.07 v56.9,51.05 | J16.GND2 v13.72,71.63 | J16.GND1 v13.72,62.99 | U3.20 19.81,69.52 v19.81,70.99 | U3.18 22.35,69.52 v22.35,70.99 | U3.22 26.04,69.32 26.04,70.48 v25.53,70.99 | U3.21 26.16,56.64 v26.16,54.48 | 29.72,40.13 26.16,40.13 25.32,39.29 C25.2 24.73,38.83 U4.6 19.41,38.83 U4.GND | U4.23 18.91,40.83 v18.8,40.72 U4.GND | U4.38 16.91,41.33 U4.GND | U4.64 21.91,36.33 U4.GND | 51.82,1.27 J6.1 J6.2 55.63,8.89 52.58,11.94 50.8,11.94 49.91,12.83 49.91,15.49 | 51.82,1.27 51.44,0.89 47.5,0.89 | J5.2 J5.1 12.45,4.39 15.95,0.89 17.91,0.89 | 17.91,0.89 18.8,1.78 J4.100 | J7.19 45.47,2.92 47.5,0.89 | 17.91,0.89 47.5,0.89 | J4.200 51.82,1.27 | C11.2 26.58,42.91 27.74,44.07 C12.2 | C9.2 17.1,32.56 v17.53,32.13 | 22.54,16.38 22.54,18.73 22.35,18.92 22.35,21.44 U8.THERMAL
  Bottom 0.203: v49.4,60.07 49.53,59.94 | E_1.1 41.78,26.54 41.66,26.42 | E_1.15 38.99,27.37 38.99,26.54 39.12,26.42 | E_1.5 40.98,26.5 40.89,26.42 | J1.MOUNT1 14.29,48.64 v15.24,48.64 | E_1.13 39.38,26.42 39.37,26.42 | E_1.11 39.78,26.52 39.88,26.42 | E_1.9 40.18,26.46 40.13,26.42
  Bottom 0.305: 45.34,26.42 41.66,26.42 40.89,26.42 40.13,26.42 39.88,26.42 39.37,26.42 39.12,26.42
  other vias: 54.99,76.2 13.08,76.2 13.08,17.78 54.99,17.78 50.67,59.82 57.91,42.29 40.13,66.42 14.73,56.77 6.1,51.44 26.67,36.58 25.65,27.18 32,43.56 20.32,28.83 23.37,48.39 9.14,51.44 2.54,33.91 50.04,53.21 20.83,33.66 50.17,42.93 43.05,38.35 40.26,35.05 57.02,32 61.09,52.83 52.45,46.99 43.56,46.48 19.18,53.85 26.04,52.07 7.24,33.78 17.53,40.72 18.8,39.45 17.53,39.45 17.53,38.18 16.26,38.18 16.26,39.45 16.26,40.72 16.26,41.99 17.53,41.99 18.8,41.99 20.07,41.99 20.07,40.72 20.07,39.45 20.07,38.18 18.8,38.18 41.17,57.35 42.44,57.35 42.44,56.08 41.17,56.08 41.17,54.81 39.9,54.81 39.9,56.08 39.9,57.35 39.9,58.62 41.17,58.62 42.44,58.62 43.71,58.62 43.71,57.35 43.71,56.08 42.44,54.81 43.71,54.81
  pour Top (rank 2): -2.79,14.61 70.87,14.61 70.87,82.55 -2.79,82.55
  pour Bottom (rank 2): -2.79,14.61 70.87,14.61 70.87,82.55 -2.79,82.55
  pour Top (no thermals): 40.87,41.81 40.87,39.52 40.05,39.52 39.52,40.05 39.52,41.43 39.01,41.94 37.11,41.94 37.11,43.33 41.02,43.33 41.02,41.81
  pour Route2: -2.79,14.61 70.87,14.61 70.87,82.55 -2.79,82.55
  cutout Top: 8.64,70.48 8.64,64.14 18.21,64.14 18.21,55.58 33.91,55.58 33.91,70.48
GPS_ENABLE_POWER  (via drill 0.2)
  Top 0.203: SW4.4 44.52,67.38 R25.1 44.63,67.44 v45.85,67.44 | U5.28 40.06,60.63 39.75,60.33 v38.86,60.33
  Bottom 0.203: v45.85,67.44 38.86,60.45 v38.86,60.33
GPS_IN_RX  (via drill 0.2)
  Top 0.203: U5.51 39.06,51.89 38.35,51.18 36.96,51.18 33.66,54.48 27.18,54.48 26.54,53.85 25.65,53.85 v25.02,54.48 24.89,54.61 24.89,56.41 U3.5
  Route2 0.203: v20.83,50.29 19.81,49.28 17.78,49.28 12.95,44.45 12.95,42.04 9.27,38.35 v9.27,37.59
  Route15 0.203: J7.15 39.12,6.98 39.12,8.89 38.48,9.52 36.7,9.52 33.4,12.83 33.4,13.59 32.13,14.86 21.46,14.86 v14.22,22.1
  Bottom 0.203: v25.02,54.48 v20.83,50.29 | v9.27,37.59 9.27,33.53 14.22,28.58 v14.22,22.1
GPS_OUT_TX  (via drill 0.2)
  Top 0.203: U5.50 38.56,51.89 38.23,51.56 37.08,51.56 33.53,55.12 v32.51,55.12 | v23.62,55.12 23.62,56.41 U3.4
  Route2 0.203: v18.8,50.29 18.29,50.29 12.57,44.58 12.57,42.16 v8.26,37.85
  Route15 0.203: J7.16 38.48,10.16 37.08,10.16 34.67,12.57 34.67,13.59 33.02,15.24 21.59,15.24 14.99,21.84 14.99,22.48 v13.46,24
  Bottom 0.203: v32.51,55.12 v23.62,55.12 v18.8,50.29 | v8.26,37.85 8.26,33.91 13.46,28.7 v13.46,24
LINUX_5V_IN
  pour Top (isolate 0.305, no thermals): 42.06,44.25 42.06,43.64 41.88,43.38 41.88,41.81 42.04,41.81 42.04,39.52 43.28,39.52 43.59,39.83 43.59,40.31 44.42,40.31 44.42,43.1 43.28,44.25
LINUX_ENABLE_POWER  (via drill 0.2)
  Top 0.203: SW3.4 46.96,42.46 R24.1 46.94,43.69 v45.97,43.69 | U4.21 19.91,45.44 20.19,45.72 29.08,45.72 v29.34,45.47
  Route15 0.203: v29.34,45.47 44.2,45.47 v45.97,43.69
MEMORY_MISO  (via drill 0.2)
  Top 0.203: U5.31 38.56,61.67 39.37,62.48 39.37,63.25 v40.01,63.88 | v32,53.09 31.24,53.09 29.85,51.69 U1.2 29.84,51.05 29.34,50.55 27.3,50.55 26.29,49.53 17.27,49.53 16.13,48.39 16.13,46.74 14.41,45.02 U4.32 14.41,43.88 v14.61,43.69
  Route2 0.203: v40.01,63.88 36.45,63.88 34.29,61.72 34.29,55.37 v32,53.09
  Bottom 0.203: v14.61,43.69 14.22,43.69 12.19,41.66 12.19,39.62 11.18,38.61 11.18,38.1 10.54,37.47 10.54,36.2 12.83,33.91 12.83,32.64 16.26,29.21 16.26,21.84 18.8,19.3 18.8,16.51 21.08,14.22 21.59,14.22 21.97,13.84 21.97,12.19 23.88,10.29 27.56,10.29 28.96,8.89 28.96,6.98 J7.7
MEMORY_MOSI  (via drill 0.2)
  Top 0.203: U4.31 14.91,45.01 16.51,46.61 16.51,48.26 17.4,49.15 19.3,49.15 | 19.3,49.15 21.47,46.99 27.94,46.99 U1.5 | U5.32 38.06,61.68 38.99,62.61 38.99,63.88 39.88,64.77 v40.13,64.77 | v20.7,48.9 20.45,49.15 19.3,49.15
  Route2 0.203: v20.7,48.9 18.01,48.9 13.34,44.22 13.34,37.72 10.41,34.8 v10.16,34.8
  Route15 0.203: v40.13,64.77 39.88,64.77 39.12,64.01 36.58,64.01 34.29,61.72 34.29,54.36 33.66,53.72 v33.53,53.72
  Bottom 0.203: v33.53,53.72 25.53,53.72 v20.7,48.9 | J7.5 26.42,6.98 26.42,8.89 25.78,9.52 22.73,9.52 19.43,12.83 19.43,13.84 18.03,15.24 18.03,19.05 15.49,21.59 15.49,28.96 12.07,32.39 12.07,32.89 v10.16,34.8
MEMORY_SCLK  (via drill 0.2)
  Top 0.203: U5.30 39.06,61.66 40.01,62.61 v40.01,62.99 | v26.16,48.26 26.54,47.88 28.45,47.88 28.89,47.44 U1.6 28.89,46.96 28.41,46.49 21.46,46.49 19.18,48.77 17.53,48.77 16.89,48.13 16.89,46.48 15.41,45 U4.30 15.41,43.77 v15.49,43.69
  Route15 0.203: v26.16,48.26 28.96,48.26 30.1,49.4 32.38,49.4 35.56,52.58 36.32,52.58 37.08,53.34 37.08,59.69 40.01,62.61 v40.01,62.99
  Bottom 0.203: v15.49,43.69 14.86,44.32 14.35,44.32 11.05,41.02 11.05,40.05 10.03,39.04 10.03,36.2 12.45,33.78 12.45,32.51 15.88,29.08 15.88,21.72 18.41,19.18 18.41,16.13 20.7,13.84 20.7,12.45 23.24,9.91 26.04,9.91 J7.6
MOD0_IN  (via drill 0.2)
  Top 0.203: U5.15 46.76,59.97 48.13,61.34 48.13,64.9 48.51,65.28 v48.51,78.23
  Bottom 0.203: J4.9 37.34,78.23 v48.51,78.23
MOD0_OUT  (via drill 0.2)
  Top 0.203: U5.40 36.89,56.97 36.2,57.66 36.2,62.61 37.21,63.63 37.85,63.63 v39.5,65.28
  Bottom 0.203: v39.5,65.28 39.5,69.47 J4.10
MOD1_IN  (via drill 0.2)
  Top 0.203: 46.5,60.47 U5.16 47.75,61.89 47.75,65.15 48.13,65.53 48.13,77.6 46.86,78.87 33.15,78.87 v32.77,79.25
  Bottom 0.203: J4.11 v32.77,79.25
MOD1_OUT  (via drill 0.2)
  Top 0.203: U5.41 36.75,56.47 35.81,57.4 35.81,62.74 v38.86,65.79
  Bottom 0.203: J4.12 33.66,73.66 34.67,72.64 35.81,72.64 38.86,69.6 v38.86,65.79
MOD2_IN  (via drill 0.2)
  Top 0.203: v30.23,78.74 30.48,78.49 46.74,78.49 47.75,77.47 47.75,65.79 46.1,64.14 45.97,64.01 43.56,61.59 U5.21
  Bottom 0.203: J4.13 v30.23,78.74
MOD2_OUT  (via drill 0.2)
  Top 0.203: U5.42 36.62,55.97 35.43,57.15 35.43,63.5 v38.23,66.29
  Bottom 0.203: J4.14 31.24,72.64 34.04,72.64 34.42,72.26 35.56,72.26 38.23,69.6 v38.23,66.29
MOD5_IN  (via drill 0.2)
  Top 0.203: v27.69,78.74 28.32,78.11 46.61,78.11 47.37,77.34 47.37,65.91 43.06,61.6 U5.22
  Bottom 0.203: J4.15 v27.69,78.74
MOD5_OUT  (via drill 0.2)
  Top 0.203: U5.43 36.48,55.47 35.05,56.9 35.05,64.26 v37.59,66.8
  Bottom 0.203: J4.16 29.08,72.26 33.78,72.26 34.16,71.88 35.31,71.88 37.59,69.6 v37.59,66.8
MOD6_IN  (via drill 0.2)
  Top 0.203: v25.15,78.74 26.16,77.72 46.48,77.72 46.99,77.22 46.99,66.04 45.72,64.77 41.8,64.77 41.06,64.03 U5.26
  Bottom 0.203: J4.17 v25.15,78.74
MOD6_OUT  (via drill 0.2)
  Top 0.203: U5.44 36.34,54.97 34.67,56.64 34.67,65.02 v36.96,67.31
  Bottom 0.203: J4.18 26.16,72.64 27.81,72.64 28.58,71.88 33.53,71.88 33.91,71.5 35.18,71.5 36.96,69.72 v36.96,67.31
MOD7_IN
  Top 0.203: J4.19 23.75,77.34 46.36,77.34 46.61,77.09 46.61,66.17 45.59,65.15 41.66,65.15 40.64,64.14 40.64,62.74 39.56,61.66 U5.29
MOD7_OUT  (via drill 0.2)
  Top 0.203: U5.49 36.96,52.19 34.29,54.86 34.29,65.79 v36.32,67.82
  Bottom 0.203: J4.20 24.13,72.14 27.69,72.14 28.32,71.5 33.4,71.5 33.78,71.12 35.05,71.12 36.32,69.85 v36.32,67.82
MODULES_SCL  (via drill 0.2)
  Top 0.203: U5.60 43.56,50.42 39.12,45.97 37.59,45.97 35.69,44.07 35.69,43.05 32.13,39.5 32.13,36.45 27.43,31.75 v20.32,31.75 | U8.14 20.1,22.32 19.43,22.99 19.43,30.86 v20.32,31.75 | U4.60 19.91,32.16 v20.32,31.75
  Bottom 0.203: v20.32,31.75 21.84,30.23 21.84,17.89 24.24,15.49 34.29,15.49 J4.24
MODULES_SCL_1V8  (via drill 0.2)
  Top 0.203: U8.7 27.85,22.32 v28.07,22.1
  Bottom 0.203: E_1.45 32.98,26.59 33.53,26.04 33.53,25.65 32.51,24.64 29.46,24.64 28.07,23.24 v28.07,22.1
MODULES_SDA  (via drill 0.2)
  Top 0.203: U4.59 19.41,33.76 v18.85,33.2 19.05,33 19.05,22.86 20.09,21.82 U8.15 | U5.59 43.06,50.42 38.99,46.36 37.47,46.36 35.31,44.2 35.31,43.18 31.75,39.62 31.75,36.65 27.49,32.39 v21.08,32.39
  Bottom 0.203: v18.85,33.2 19.66,32.39 v21.08,32.39 22.35,31.12 22.35,17.94 24.42,15.88 33.91,15.88 35.31,17.27 35.31,19.05 J4.23
MODULES_SDA_1V8  (via drill 0.2)
  Top 0.203: U8.6 27.21,21.82 v27.43,21.59
  Bottom 0.203: E_1.47 32.58,26.48 33.02,26.04 33.02,25.65 32.38,25.02 29.34,25.02 27.43,23.11 v27.43,21.59
N$1
  Top 0.305: FB1.1 17.15,69.98 18.84,71.67 22.75,71.67 | 22.75,71.67 23.62,70.8 23.62,69.52 U3.17 | 22.75,71.67
N$2
  Top 0.203: R1.2 58.91,56.77 U2.1
N$3
  Top 0.356: J16.SIG 15.27,67.33 FB1.2 17.17,67.31 19.3,67.31 21.03,69.04 U3.19
N$4
  Top 0.203: R2.2 58.91,55.63 U2.12
N$5
  Top 0.203: J3.2 63.89,38.86 60.58,38.86 58.8,40.64 58.04,40.64 57.64,40.24 U7.7
N$6
  Top 0.203: J3.3 63.9,38.1 60.58,38.1 58.8,36.32 58.04,36.32 57.64,36.73 U7.1
N$7
  Top 0.203: D3.2 33.6,50.27 R8.1
N$8
  Top 0.203: R9.1 32.51,48.16 D3.4
N$9
  Top 0.203: R10.1 33.78,48.21 D3.3
N$10
  Top 0.406: J2.1 63.01,57.13 62.61,57.53 62.61,58.2 FB2.P$2
N$11  (via drill 0.2)
  Top 0.203: J13.1 27.69,26.8 27.69,25.65 28.32,25.02 31.12,25.02 31.5,25.4 v31.5,26.04
  Bottom 0.203: E_1.53 31.38,26.16 v31.5,26.04
N$12
  Top 0.203: U8.12 20.61,25.41 R7.2
N$13  (via drill 0.2)
  Top 0.203: J13.3 31.6,26.82 32.38,26.04 v32.38,25.85
  Bottom 0.203: v32.38,25.85 32.38,26.04 31.78,26.64 E_1.51
N$14
  Top 0.305: L1.P$1 | VR1.6 41.45,39.3 41.46,39.3
  Top 0.711: L1.P$1 41.46,39.3
N$15
  Top 0.508: D1.CATHODE 52.92,44.48 J9.2
N$16
  Top 0.305: 46.86,40.89 46.93,40.83 SW3.1 | 45.41,40.89 J10.1
  Top 0.406: 45.41,40.89 46.86,40.89
N$17  (via drill 0.2)
  Top 0.203: v43.31,32.64 44.2,33.53 44.2,35.56 47.25,38.62 U6.4
  Bottom 0.203: E_1.3 41.38,28.17 42.67,29.46 42.67,32 v43.31,32.64
N$18
  Top 0.305: SW5.1 3.88,54.3 J12.1
N$19
  Top 0.203: J11.1 40.31,67.38
  Top 0.305: 40.31,67.38 SW4.1
N$24
  Top 0.203: U2.7 55.77,53.42 R3.1
N$25
  Top 0.203: U2.10 57.13,54.2 57.81,53.52 R4.1
N$28
  Top 0.203: U2.4 56.67,59.43 C7.1
  Top 0.305: C7.1 56.64,59.41 56.64,58.04
  Top 0.406: FB2.P$1 56.77,59.49 C7.1
N$29
  Top 0.203: U4.25 17.91,46.13 C8.1 17.93,47.65 FB3.1
N$30
  Top 0.203: U7.10 52.85,38.08 52.2,38.73 52.2,41.15 52.66,41.61 R23.2 53.48,42.33 Q1.D2
N$32
  Top 0.203: U5.25 41.56,62.64 C13.1 41.6,62.79 41.6,63.5 FB4.1
N$34
  Top 0.203: D2.2 24.64,25.73 R5.1
N$37
  Top 0.203: R6.1 22.45,26.8 D2.4
N$38
  Top 0.203: R7.1 22.45,25.53 D2.3
N$44
  Top 0.203: 50.04,57.94 L3.P$1
  Top 0.305: U5.7 47.84,55.97 48.62,56.75 C17.1 50.04,57.94 | C26.1 51.74,58.22 L3.P$1
N$45
  Top 0.305: U4.7 24.09,39.33 24.92,40.16 C25.1 26.42,41.38 L2.P$1 28.78,41.79 C12.1
N$46
  Top 0.305: U4.5 27.72,38.33 L2.P$2
N$48
  Top 0.203: U4.34 13.18,43.33 12.95,43.56 13.22,43.83 U4.33
N$50
  Top 0.203: U8.13 20.11,22.82 19.81,23.11 19.81,25.88 R6.2
N$51
  Top 0.203: U4.37 14.27,41.83 14.48,42.04 14.18,42.33 U4.36
N$53
  Top 0.203: U5.37 37.89,58.47 38.1,58.67 37.81,58.97 U5.36
N$54
  Top 0.203: U5.33 37.83,60.47 38.1,60.2 37.87,59.97 U5.34
N$56
  Top 0.305: U3.12 31.19,69.01 31.88,68.33 32.13,68.58 | 32.13,68.58 32.46,68.91 U3.11 | J11.2 40.23,68.68 | J11.2 32.13,68.58 | C18.1 41.5,68.58 J11.2
N$58  (via drill 0.2)
  Top 0.305: R14.2 R13.2 | J12.2 6.55,55.37 C27.1 7.14,55.27 R13.2 | R13.2 8.2,53.09 | 8.2,53.09 R15.2 8.2,48.68 R21.2 | v13.21,53.09 8.2,53.09
  Bottom 0.305: v13.21,53.09 16.74,53.09 J1.4
N$59
  Top 0.203: 51.46,54.97 L3.P$2
  Top 0.305: U5.5 51.46,54.97
PPS  (via drill 0.2)
  Top 0.203: U3.3 22.3,55.42 24.26,53.47 29.34,53.47 29.54,53.67 32.44,53.67 32.77,53.34 32.77,53.09 36.32,49.53 36.32,45.72 30.99,40.39 v30.99,37.59
  Bottom 0.203: v30.99,37.59 30.99,35.81 27.43,32.26 24.38,32.26 22.86,30.73 22.86,18.03 24.64,16.26 32.13,16.26 32.89,17.02 32.89,18.42 34.04,19.56 J4.25
SD_ENABLE_POWER  (via drill 0.2)
  Top 0.203: R26.1 4.09,47.09 v5.08,46.1 | v17.02,34.67 17.41,35.06 U4.55
  Top 0.305: R26.1 3.88,50.22 SW5.4
  Route15 0.203: v5.08,46.1 6.1,45.09 8.26,45.09 10.03,43.31 10.03,37.34 12.7,34.67 v17.02,34.67
SD_MISO  (via drill 0.2)
  Top 0.203: U4.42 13.12,39.33 11.81,40.64 11.81,42.04 11.05,42.8 11.05,45.72 13.21,47.88 v13.21,49.78 | J7.2 22.61,9.65 19.43,12.83 19.43,13.84 17.91,15.37 17.91,19.18 15.62,21.46 15.62,29.08 11.43,33.27 11.43,36.96 v11.18,37.21
  Top 0.305: v13.21,49.78 9.1,49.78 R15.1
  Route15 0.203: v13.21,49.78 13.21,47.88 11.05,45.72 11.05,42.8 11.81,42.04 11.81,39.24 11.18,38.61 v11.18,37.21
  Bottom 0.305: v13.21,49.78 16.74,49.78 J1.7
SD_MOSI  (via drill 0.2)
  Top 0.203: U4.43 13.11,38.83 11.43,40.51 11.43,41.91 10.67,42.67 10.67,46.48 v12.45,48.26 | J7.1 20.57,7.75 20.57,10.41 18.54,12.45 18.16,12.83 18.16,13.84 17.53,14.48 17.53,19.05 15.24,21.34 15.24,28.96 11.05,33.15 11.05,36.45 10.54,36.96 10.54,38.73 v10.67,38.86
  Top 0.305: v12.45,54.23 9.09,54.23 R13.1
  Route15 0.203: v12.45,48.26 10.67,46.48 10.67,42.67 11.43,41.91 11.43,39.62 v10.67,38.86
  Bottom 0.203: v12.45,48.26 v12.45,54.23
  Bottom 0.305: v12.45,54.23 16.75,54.23 J1.3
SD_SCLK  (via drill 0.2)
  Top 0.203: U4.41 13.13,39.83 12.19,40.77 12.19,42.16 11.43,42.93 11.43,45.47 13.84,47.88 v13.84,51.94 | J7.3 23.88,6.98 23.88,9.27 20.7,12.45 20.7,13.84 18.29,16.26 18.29,19.3 16,21.59 16,29.21 11.81,33.4 11.81,38.35 v11.94,38.48
  Route15 0.203: v13.84,51.94 13.84,47.88 11.43,45.47 11.43,42.93 12.19,42.16 12.19,38.73 v11.94,38.48
  Bottom 0.203: v13.84,51.94 16.7,51.94 J1.5
SMBCLK  (via drill 0.2)
  Top 0.203: J4.5 39.12,74.93 39.12,73.15 38.1,72.14 36.2,72.14 34.42,70.36 v34.42,69.47 | U5.56 41.56,50.45 40.01,48.9 37.85,48.9 35.81,50.93 35.43,50.93 34.42,51.94 v34.42,52.58
  Bottom 0.203: v34.42,69.47 v34.42,52.58
SMBDATA  (via drill 0.2)
  Top 0.203: J4.3 41.66,74.93 41.66,73.15 39.75,71.25 37.59,71.25 v35.69,69.34 | U5.55 41.06,50.46 39.88,49.28 37.97,49.28 v35.69,51.56
  Bottom 0.203: v35.69,69.34 v35.69,51.56
STORAGE_BUCK/LDO_N
  Top 0.203: U4.3 28.2,37.33 R11.1 R28.2
STORAGE_DEBUG_GPIO1  (via drill 0.2)
  Top 0.203: U4.19 20.91,43.99 v21.21,43.69
  Bottom 0.203: v21.21,43.69 21.34,43.56 21.34,41.53 20.83,41.02 20.83,39.5 21.08,39.24 21.08,37.59 16,32.51 16,30.99 17.4,29.59 17.4,22.23 19.94,19.69 19.94,16.89 20.83,16 22.1,16 23.75,14.35 26.42,14.35 27.05,13.72 27.05,12.57 29.72,9.91 30.86,9.91 31.75,9.02 31.75,7.62 32.13,7.24 33.53,7.24 34.29,6.48 34.29,4.95 35.05,4.19 45.47,4.19 47.75,6.48 47.75,8.13 48.64,9.02 52.2,9.02 52.83,8.38 52.83,4.57 52.07,3.81 50.55,3.81 J4.201
STORAGE_DEBUG_GPIO2  (via drill 0.2)
  Top 0.203: U4.20 20.41,44.16 v19.94,43.69
  Bottom 0.203: v19.94,43.69 17.4,43.69 16.76,43.05 16.26,43.05 13.59,40.39 13.59,32.89 17.02,29.46 17.02,22.1 19.56,19.56 19.56,16.76 20.7,15.62 21.97,15.62 23.62,13.97 24.26,13.97 24.51,13.72 24.51,11.68 25.15,11.05 28.07,11.05 29.59,9.52 30.73,9.52 31.37,8.89 31.37,7.47 32.11,6.73 33.4,6.73 33.91,6.22 33.91,4.57 34.67,3.81 45.59,3.81 48.13,6.35 48.13,8 48.77,8.64 50.8,8.64 J4.204
STORAGE_DEBUG_RX
  Top 0.203: U4.46 13.2,37.33 12.57,36.7 12.57,33.66 16.76,29.46 16.76,21.84 19.05,19.56 19.05,16.76 20.83,14.99 22.1,14.99 23.24,13.84 23.24,12.07 26.29,9.02 26.29,4.83 27.3,3.81 43.31,3.81 44.45,4.95 44.45,6.22 44.96,6.73 47.62,6.73 J4.203
STORAGE_DEBUG_TX
  Top 0.203: U4.47 13.21,36.83 12.95,36.58 12.95,33.78 17.15,29.59 17.15,21.97 19.43,19.69 19.43,16.89 20.96,15.37 22.99,15.37 24.51,13.84 24.51,11.3 24.77,11.05 26.67,9.14 26.67,4.95 27.43,4.19 43.18,4.19 44.07,5.08 44.07,6.35 44.83,7.11 48.01,7.11 48.77,6.35 50.55,6.35 J4.202
STORAGE_SWDCLK  (via drill 0.2)
  Top 0.203: J14.4 6.63,41.78 v9.02,41.78 | v24.89,44.2 24.89,43.56 R18.1 24.13,42.6 24.13,41.28 23.19,40.33 U4.9 22.04,40.33 v21.84,40.13 | v47.24,9.65 47.5,9.65 48.39,8.76 50.42,8.76 J4.206
  Bottom 0.203: v24.89,44.2 24.38,44.7 12.45,44.7 9.53,41.78 v9.02,41.78 | v21.84,40.13 21.84,37.34 16.76,32.26 16.76,31.24 18.16,29.85 18.16,22.48 20.7,19.94 20.7,17.15 21.08,16.76 22.35,16.76 24,15.11 28.45,15.11 29.59,13.97 29.59,12.83 32.38,10.03 33.27,10.03 34.29,9.02 34.29,7.62 34.67,7.24 46.1,7.24 46.74,7.87 46.74,9.14 v47.24,9.65
STORAGE_SWDIO  (via drill 0.2)
  Top 0.203: J14.2 5.97,42.39 v5.97,44.32 | R17.1 25.65,45.09 v25.27,45.09 24.51,45.09 24.26,44.83 24.26,43.31 23.75,42.8 23.75,41.53 23.05,40.83 U4.10 22.16,40.83 v21.84,41.15
  Bottom 0.203: v5.97,44.32 6.73,45.09 v25.27,45.09 | v21.84,41.15 21.21,40.51 21.21,39.62 21.46,39.37 21.46,37.47 16.38,32.39 16.38,31.12 17.78,29.72 17.78,22.35 20.32,19.81 20.32,17.02 20.96,16.38 22.23,16.38 23.88,14.73 27.43,14.73 28.32,13.84 28.32,12.57 28.7,12.19 29.46,12.19 32,9.65 33.15,9.65 33.78,9.02 33.78,7.49 34.54,6.73 46.36,6.73 47.24,7.62 47.24,8.13 J4.207
STORAGE_XIN
  Top 0.203: X1.3 24.21,33.2 | U4.1 22.69,35.05 X1.3 | C1.1 24.21,33.2 | 24.21,33.2 X1.3
STORAGE_XOUT
  Top 0.203: U4.2 24.3,36.83 X1.1 26.47,34.67 26.67,34.67 27.23,34.11 C2.1
USB_D+  (via drill 0.2)
  Top 0.203: U7.3 58.74,37.78 v59.05,37.47
  Bottom 0.203: E_1.16 38.99,30.03 38.99,31.24 41.02,33.27 43.18,33.27 43.81,33.91 56.26,33.91 56.56,34.21 57.48,34.21 58.42,33.27 59.18,33.27 59.69,33.78 59.69,34.54 60.2,35.05 60.96,35.05 61.47,35.56 61.47,36.32 60.96,36.83 59.69,36.83 v59.05,37.47
USB_D-  (via drill 0.2)
  Top 0.203: U7.5 58.74,39.18 v59.05,39.5
  Bottom 0.203: v59.05,39.5 59.82,40.26 59.82,40.77 59.18,41.4 56.13,41.4 55.12,40.39 55.12,37.34 52.07,34.29 43.69,34.29 43.05,33.66 40.89,33.66 38.58,31.34 E_1.18
USB_MOD_D+  (via drill 0.2)
  Top 0.203: U7.2 58.04,37.34 v58.42,36.96 | v56.64,36.07 55.63,36.07 54.99,35.43 54.99,32.89 53.98,31.88 45.34,31.88 43.81,30.35 43.81,26.8 39.24,22.23 31.37,22.23 30.35,21.21 30.35,19.51 30.81,19.05 32.1,19.05 32.64,19.59 32.64,20.45 32.26,20.83 31.75,20.83 31.5,20.57 J4.27
  Bottom 0.203: v58.42,36.96 58.42,35.67 58.06,35.31 57.4,35.31 v56.64,36.07
USB_MOD_D-  (via drill 0.2)
  Top 0.203: U7.6 58.04,39.62 v58.42,40.01 | v56.13,36.83 55.88,36.83 54.61,35.56 54.61,33.02 53.85,32.26 45.21,32.26 43.43,30.48 43.43,26.92 39.12,22.61 31.24,22.61 29.97,21.34 29.97,19.3 J4.28
  Bottom 0.203: v58.42,40.01 58.29,40.01 57.53,40.77 56.77,40.77 56.13,40.13 v56.13,36.83
USB_VBUS  (via drill 0.2)
  Top 0.203: v48.64,35.31 48.66,35.31 U6.1 50.69,36.72 51.69,37.72 51.69,41.78 53.09,43.18 53.85,43.18 54.75,44.08 D1.ANODE
  Top 0.406: J3.1 63.17,39.45 59.18,43.43 56.9,43.43 | 56.9,43.43 55.79,42.33 Q1.G2 | 56.9,43.43 56.69,43.64 R22.1
  Top 0.508: D1.ANODE 55.76,43.43 56.9,43.43
  Bottom 0.203: E_1.20 38.18,31.45 40.77,34.04 42.8,34.04 43.43,34.67 48.01,34.67 v48.64,35.31
VCC_CONTROLLER  (via drill 0.2, 0.41)
  Top 0.203: C16.1 49.02,58.42 49.96,59.36 R20.2 49.96,62.41 R19.2 49.71,64.19 50.67,65.15 52.76,65.15 J15.1 | R12.2 52.25,53.8 v52.83,53.21 | 36.58,59.69 36.8,59.47 U5.35 37.32,59.44 v38.23,59.44 | U5.39 36.89,57.47 36.58,57.79 36.58,59.69 | FB3.2 18.82,47.47 v19.3,46.99 | U4.35 13.67,42.8 | 13.67,42.8 v14.61,42.8 | 13.67,42.8 13.21,42.8 12.95,42.55 | 12.95,42.55 12.95,41.15 13.27,40.83 U4.39 | 12.95,42.55 12.4,43.1 C10.1 | J14.1 4.19,42.39 4.19,44.2 v4.32,44.32 | C11.1 24.97,42.37 25.86,43.26 R18.2 26.87,44.48 R17.2 | 36.58,59.69 36.58,62 C15.1 | U5.52 39.56,50.53 C14.1 40.27,50.5 v40.39,50.61 | U5.61 44.06,51.07 v44.32,50.8 | v44.07,64.01 FB4.2
  Top 0.305: U5.8 47.07,56.47 v48.26,57.66 48.84,58.24 C16.1 | v42.93,66.04 43.32,66.44 SW4.3 44.32,66.88 R25.2 | R26.2 3.38,50.17 SW5.3 2.76,50.8 v2.29,50.8 | U1.7 29.84,46.62 30.23,46.23 30.79,46.79 U1.8 31.88,48.31 v31.88,48.64 32.49,49.25 D3.1 | U1.3 28.86,51.26 C19.1 29.59,52.7 v29.72,52.58 | U4.8 23.58,39.83 v24.77,41.02 24.97,41.22 C11.1 | R11.2 29.29,37.26 v29.85,36.7 | U4.52 15.93,35.54 v15.93,34.1 15.93,33.37 C9.1 | U4.61 20.41,35.09 v21.08,34.42
  Top 0.508: C29.1 v50.04,72.64
  Route15 0.203: v52.83,53.21 52.83,53.34
  Route15 0.305: J7.20 46.1,8.89 46.1,13.97 45.85,14.22 34.8,14.22 33.27,15.75 21.97,15.75 21.21,16.51
  pour Route15: -2.79,82.55 58.93,82.55 58.93,64.9 54.1,60.07 54.1,50.78 50.95,47.62 40.15,47.62 32.51,39.99 32.51,36.58 21.97,26.04 21.97,14.61 -2.74,14.61
VCC_LINUX  (via drill 0.41)
  Top 0.305: 47.83,42.46 SW3.3 | 49.02,43.66 49.02,37.97 U6.5
  Top 0.406: 47.83,42.46 R24.2
  Top 0.508: J9.1 49.17,43.66 49.02,43.66 R24.2 v47.83,45.64
  Route15 0.305: J7.17 44.2,6.98 46.23,6.98 48.01,8.76 48.01,11.43 48.64,12.07 48.64,15.49
  Bottom 0.508: J4.4 48.01,68.58 48.01,61.47 48.64,60.83 52.2,60.83 54.1,58.93 54.1,51.91 v47.83,45.64
  pour Route15: 22.48,14.61 22.48,25.78 33.02,36.32 33.02,39.79 40.17,46.94 51.25,46.94 54.99,50.68 54.99,59.75 56.96,61.72 70.87,61.72 70.87,14.61
VCC_LINUX_1V8  (via drill 0.2)
  Top 0.203: U8.2 C24.2 23.89,18.29 v24.64,18.29 | v41.91,34.8 41.91,32.89 40.64,31.62 v40.39,31.62 | v56.13,50.04 56.13,52.58 56.52,52.96 C23.1 | U8.10 23.43,24.13 v24.64,24.13
  Top 0.305: U2.9 56.67,53.17 C23.1
  Route2 0.203: J7.14 36.83,8.26 32.13,12.95 32.13,13.59 31.24,14.48 28.45,14.48 v24.64,18.29
  Route15 0.305: v40.39,31.62 40.39,29.06 39.01,27.69 28.07,27.69 v27.05,28.7 | v24.64,24.13 24.26,23.75 24.26,18.67 v24.64,18.29
  Bottom 0.203: E_1.12 39.78,31.01 v40.39,31.62 | v41.91,34.8 41.91,35.18 46.23,39.5 48.39,39.5 56.13,47.24 v56.13,50.04
  Bottom 0.305: v24.64,24.13 27.05,26.54 v27.05,28.7
VCC_LINUX_3V3  (via drill 0.2, 0.41)
  Top 0.203: v53.59,40.13 53.36,40.13 R23.1 C22.1 52.7,39.14 53.37,38.48 U7.9 | v21.27,18.29 21.22,18.34 C21.2 20.49,19.69 U8.19
  Top 0.305: VR1.3 41.2,44.4 40.89,44.7 40.7,44.51 VR1.4 40.69,43.94 v39.88,43.94 | C20.1 38.51,28.68 v38.35,28.83 | v24.89,30.99 22.99,29.08 22.99,27.56 23.52,27.03 D2.1 | v44.83,15.49 44.83,10.16 J7.18
  Route15 0.305: v53.59,40.13 50.55,37.08 v36.83,37.08 | v44.83,15.49 44.07,14.73 35.05,14.73 33.53,16.26 23.5,16.26 21.46,18.29 v21.27,18.29 21.27,27.37 v24.89,30.99
  Bottom 0.203: 40.89,29.08 41.4,29.08 41.38,29.11 E_1.4 | 40.89,29.08 39.24,29.08 39.38,29.22 E_1.14 | E_1.6 40.98,29.17 40.89,29.08 | 41.66,29.08 41.78,29.2 E_1.2
  Bottom 0.305: v39.88,43.94 39.5,43.56 39.5,40.01 38.86,39.37 v38.35,39.37 | 41.4,29.08 41.15,28.83 41.4,28.83 41.66,29.08 | v24.89,30.99 25.15,31.24 v35.05,31.24
  Bottom 0.508: v36.32,28.83 v37.34,28.83 v38.35,28.83 41.15,28.83
  pour Top (no thermals): 39.01,41.17 39.01,38.76 39.4,38.38 39.16,28.93 38.46,28.24 35.53,28.24 34.31,29.49 34.49,38.6 37.12,41.17

## Text on the board
tPlace: MOD7IN | MOD6IN | MOD5IN | MOD2IN | MOD1IN | MOD0IN | SMBCLK | SMBDAT | GND | MOD7OUT | MOD6OUT | MOD5OUT | MOD2OUT | MOD1OUT | MOD0OUT | !SMBALERT | VCC_LINUX | VCC_CONT | Controller | Signpost Controller / Branden Ghena / 1/22/2017 | B | OUT | LED2 | GND | EDISON / DEBUG | IN | LED1 | !PWRBTN | Storage / Master | CS0 | CS1 | Edison / CS Pin | Edison / Sleep | USBD+ | PPS | MODSDA | GND | Backplane / Reset | USBD- | MODSCL | !BPRST | SWDIO | SWCLK | SWDIO | SWCLK | Controller | SD_MISO | !SD_CS | MEM_SCLK | !SM_CS | ED_SCLK | ED_MISO | LNX_1V8 | GPS_OUT | LNX_3V3 | VCC_CONT | Storage / Master | !RST | GPIO2 | !RST | GPIO2 | RX | TX | RX | TX | SD_MOSI | SD_SCLK | MEM_MOSI | MEM_MISO | !FRAM_CS | ED_MOSI | !ED_CS | GPS_IN | VCC_LINUX | GND | GND | GND | GPIO1 | GND | GPIO1 | GPIO1 | GND
bPlace: Edison / Serial | Edison / Program